# Altium schematic sheet User_buttom.SchDoc
size A4
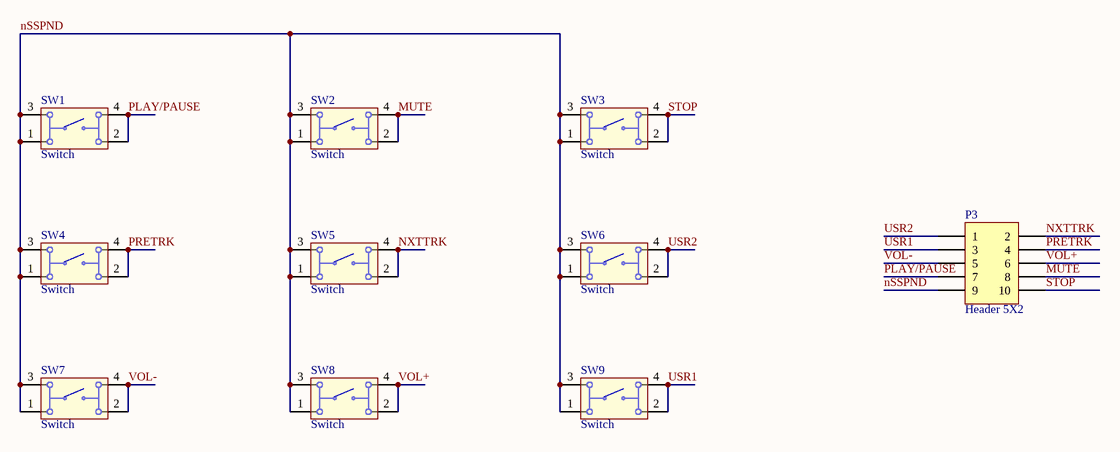
[diagram p0: User_buttom.SchDoc]

## Parts
P3  Header 5X2  [HDR2X5]
SW1  Switch  [430156050726]
SW2  Switch  [430156050726]
SW3  Switch  [430156050726]
SW4  Switch  [430156050726]
SW5  Switch  [430156050726]
SW6  Switch  [430156050726]
SW7  Switch  [430156050726]
SW8  Switch  [430156050726]
SW9  Switch  [430156050726]

## Nets
MUTE: P3.8 SW2.2 SW2.4
nSSPND: P3.9 SW1.1 SW1.3 SW2.1 SW2.3 SW3.1 SW3.3 SW4.1 SW4.3 SW5.1 SW5.3 SW6.1 SW6.3 SW7.1 SW7.3 SW8.1 SW8.3 SW9.1 SW9.3
NXTTRK: P3.2 SW5.2 SW5.4
PLAY/PAUSE: P3.7 SW1.2 SW1.4
PRETRK: P3.4 SW4.2 SW4.4
STOP: P3.10 SW3.2 SW3.4
USR1: P3.3 SW9.2 SW9.4
USR2: P3.1 SW6.2 SW6.4
VOL+: P3.6 SW8.2 SW8.4
VOL-: P3.5 SW7.2 SW7.4

## Library data of the parts
P3 = Header 5X2: Header, 5-Pin, Dual row; LatestRevisionDate: 17-Jul-2002; LatestRevisionNote: Re-released for DXP Platform.; Publisher: Altium Limited
SW1-SW9 = 430156050726: WS-TATV THT Tact Switch 6X6 mm; NoPins: 04; PackageReference: 430156050726; PartNumber: 430156050726; ComponentLink1Description: Manufacturer URL; ComponentLink1URL: http://www.we-online.com; ComponentLink2Description: Datasheet; ComponentLink2URL: http://katalog.we-online.de/em/datasheet/4301x6.pdf